# Altium schematic sheet CPU MISC.schdoc
size 451 x 234 mm
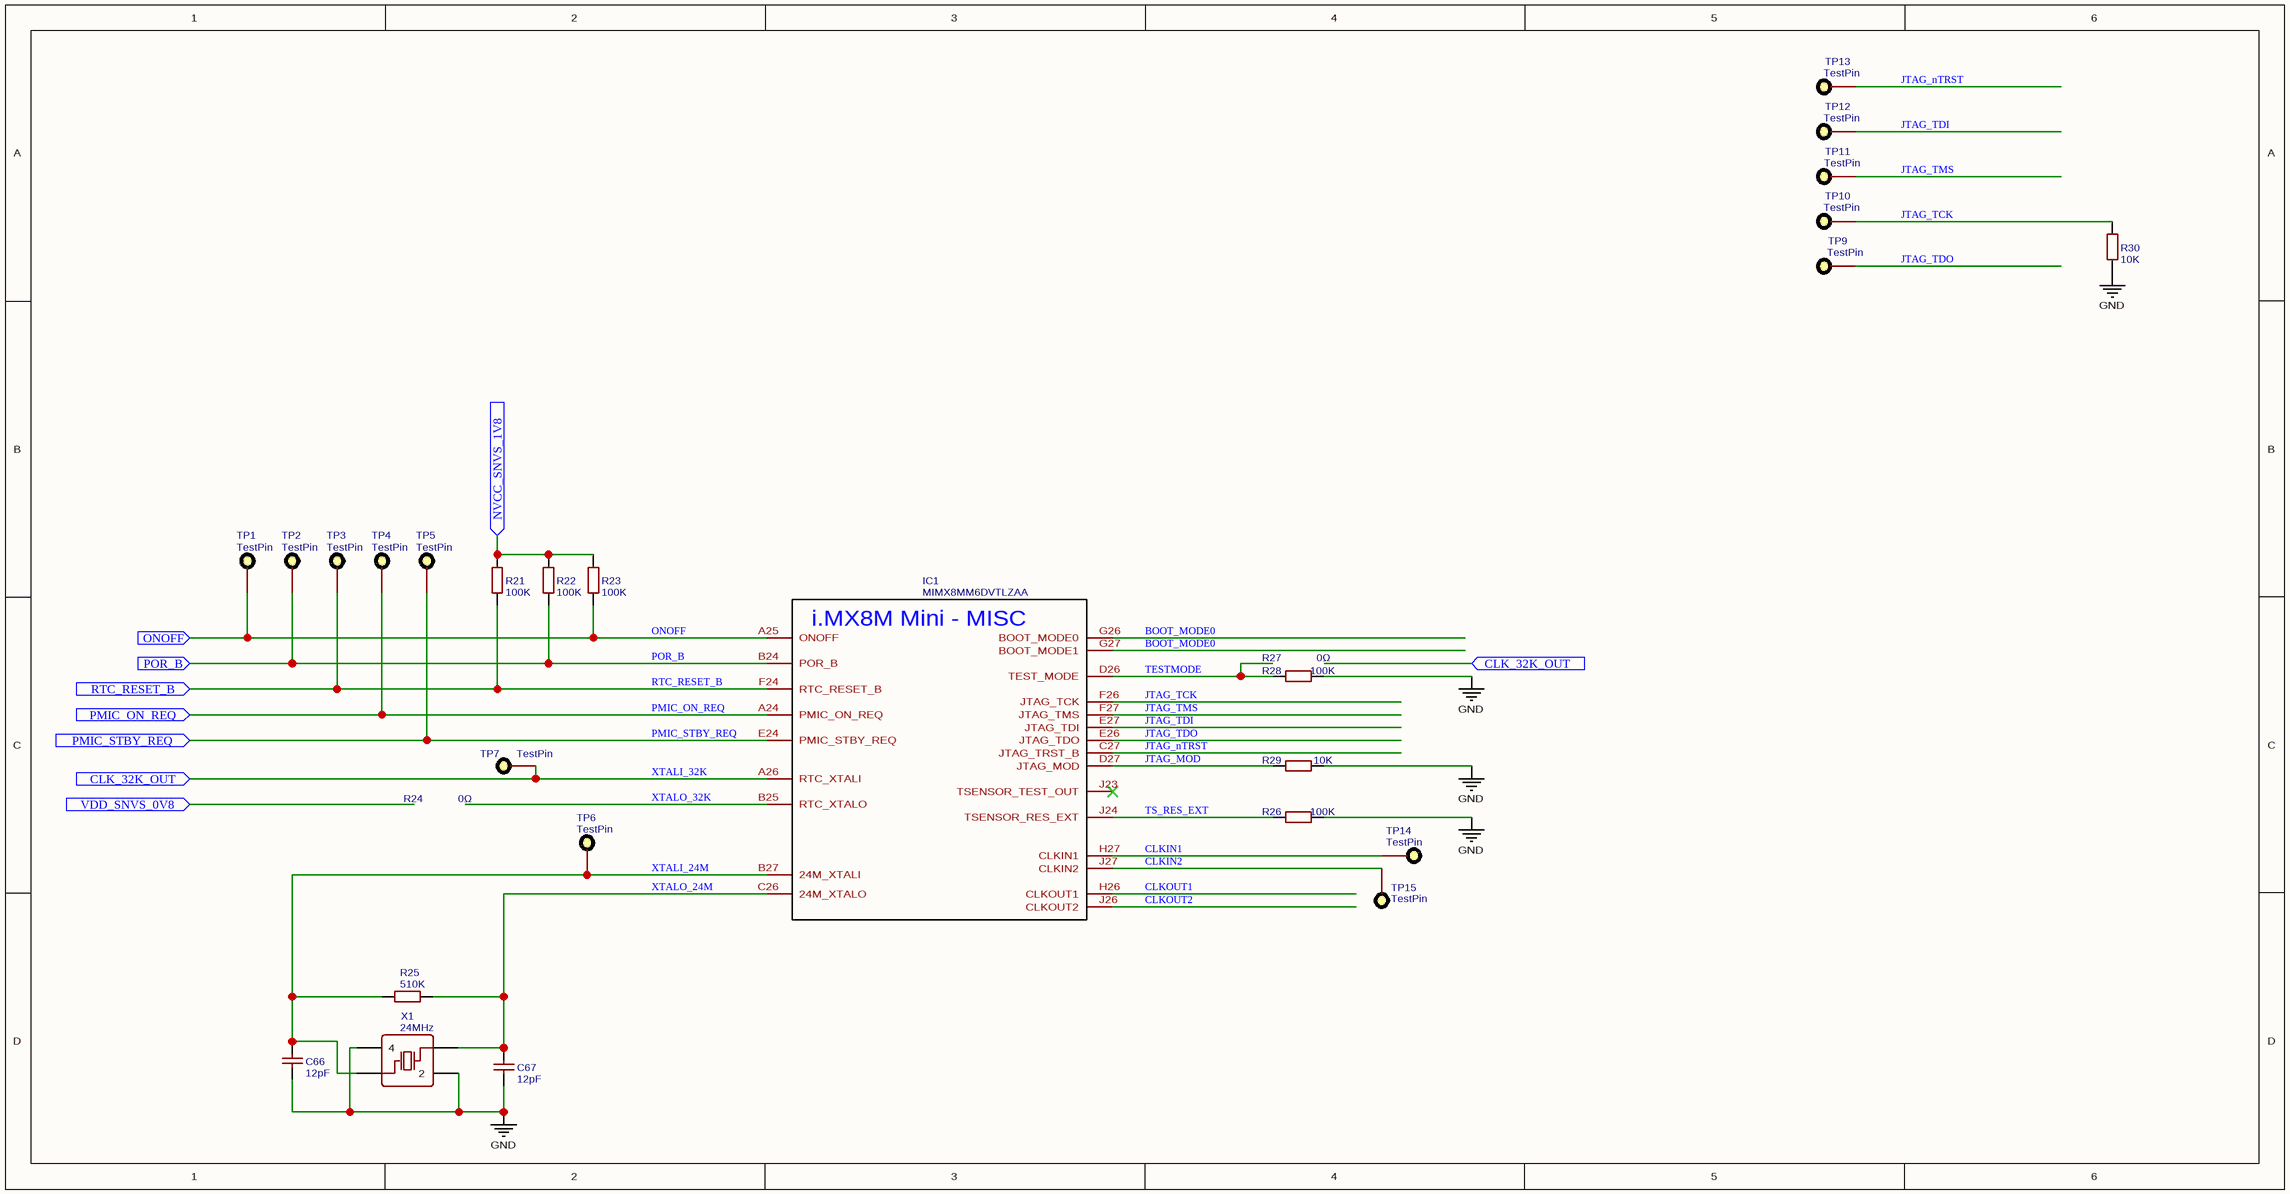
[diagram p0: CPU MISC.schdoc]

## Parts
C66  12pF  [C0402]
C67  12pF  [C0402]
IC1  MIMX8MM6DVTLZAA  [BGA486C50P27X27_1400X1400X125]
R21  100K  [R0402]
R22  100K  [R0402]
R23  100K  [R0402]
R24  0Ω  [1206]
R25  510K  [R0402]
R26  100K  [R0402]
R27  0Ω  [1206]
R28  100K  [R0402]
R29  10K  [R0402]
R30  10K  [R0402]
TP1  TestPin  [TESTPIN]
TP2  TestPin  [TESTPIN]
TP3  TestPin  [TESTPIN]
TP4  TestPin  [TESTPIN]
TP5  TestPin  [TESTPIN]
TP6  TestPin  [TESTPIN]
TP7  TestPin  [TESTPIN]
TP9  TestPin  [TESTPIN]
TP10  TestPin  [TESTPIN]
TP11  TestPin  [TESTPIN]
TP12  TestPin  [TESTPIN]
TP13  TestPin  [TESTPIN]
TP14  TestPin  [TESTPIN]
TP15  TestPin  [TESTPIN]
X1  24MHz  [OSC-SMD_4P-L3.2-W2.5-BL]

## Ports
CLK_32K_OUT (in), NVCC_SNVS_1V8 (in), ONOFF (in), PMIC_ON_REQ (in), PMIC_STBY_REQ (in), POR_B (in), RTC_RESET_B (in), VDD_SNVS_0V8 (in)

## Nets
GND: C66.1 C67.1 R26.1 R28.1 R29.2 R30.1 X1.2 X1.4
BOOT_MODE0: IC1.G26(BOOT_MODE0) IC1.G27(BOOT_MODE1)
CLKIN1: IC1.H27(CLKIN1) TP14.1
CLKIN2: IC1.J27(CLKIN2) TP15.1
CLKOUT1: IC1.H26(CLKOUT1)
CLKOUT2: IC1.J26(CLKOUT2)
JTAG_MOD: IC1.D27(JTAG_MOD) R29.1
JTAG_nTRST: IC1.C27(JTAG_TRST_B) TP13.1
JTAG_TCK: IC1.F26(JTAG_TCK) R30.2 TP10.1
JTAG_TDI: IC1.E27(JTAG_TDI) TP12.1
JTAG_TDO: IC1.E26(JTAG_TDO) TP9.1
JTAG_TMS: IC1.F27(JTAG_TMS) TP11.1
NVCC_SNVS_1V8: R21.2 R22.2 R23.2 ; port NVCC_SNVS_1V8
ONOFF: IC1.A25(ONOFF) R23.1 TP1.1 ; port ONOFF
PMIC_ON_REQ: IC1.A24(PMIC_ON_REQ) TP4.1 ; port PMIC_ON_REQ
PMIC_STBY_REQ: IC1.E24(PMIC_STBY_REQ) TP5.1 ; port PMIC_STBY_REQ
POR_B: IC1.B24(POR_B) R22.1 TP2.1 ; port POR_B
RTC_RESET_B: IC1.F24(RTC_RESET_B) R21.1 TP3.1 ; port RTC_RESET_B
TESTMODE: IC1.D26(TEST_MODE) R28.2
TS_RES_EXT: IC1.J24(TSENSOR_RES_EXT) R26.2
XTALI_24M: C66.2 IC1.B27(24M_XTALI) R25.1 TP6.1 X1.1(OSC1)
XTALI_32K: IC1.A26(RTC_XTALI) TP7.1 ; port CLK_32K_OUT
XTALO_24M: C67.2 IC1.C26(24M_XTALO) R25.2 X1.3(OSC2)
XTALO_32K: IC1.B25(RTC_XTALO)

Not connected (* = marked no-connect by the designer): IC1 J23(TSENSOR_TEST_OUT)*

## Notes on the sheet
- (in symbol MIMX8MM6DVTLZAA) i.MX8M Mini - MISC

## Library data of the parts
C66 C67 = 12pF: BOM_Manufacturer: FH; BOM_Manufacturer Part: 0402CG120J500NT; nameAlias: Capacitance; SMT Type: Basic; BOM_Supplier: LCSC; BOM_Supplier Part: C1547; BOM_JLCPCB SMD: Yes; spicePre: C; spiceSymbolName: 0402CG120J500NT
IC1 = MIMX8MM6DVTLZAA: subpart_no: 2; Contributor: Ke'Ondrae_Mell; spicePre: I; spiceSymbolName: MIMX8MM6DVTLZAA
R21-R23 R26 R28 = 100K: BOM_Manufacturer: UniOhm; BOM_Manufacturer Part: 0402WGF1003TCE; nameAlias: Resistance (Ohms); SMT Type: Basic; BOM_Supplier: LCSC; BOM_Supplier Part: C25741; BOM_JLCPCB SMD: Yes; spicePre: R; spiceSymbolName: 0402WGF1003TCE
R24 R27 = 0Ω: BOM_Manufacturer Part: 0R(000) ±1%; Value: 0Ω; BOM_Supplier Part: undefined; BOM_Supplier: LCSC; spicePre: R; spiceSymbolName: 0Ω
R25 = 510K: BOM_Manufacturer: UniOhm; BOM_Manufacturer Part: 0402WGF5103TCE; nameAlias: Resistance (Ohms); SMT Type: Basic; BOM_Supplier: LCSC; BOM_Supplier Part: C11616; BOM_JLCPCB SMD: Yes; spicePre: R; spiceSymbolName: 0402WGF5103TCE
R29 R30 = 10K: BOM_Manufacturer: UniOhm; BOM_Manufacturer Part: TC0225F1002TCE; nameAlias: Resistance (Ohms); SMT Type: Extend; BOM_Supplier: LCSC; BOM_Supplier Part: C98838; BOM_JLCPCB SMD: Yes; spicePre: R; spiceSymbolName: TC0225F1002TCE
TP1-TP7 TP9-TP15 = TestPin: Contributor: alan.green; sourceId: WTb5nFXR9; timeStamp: 1460711565; spicePre: T; spiceSymbolName: TestPin
X1 = 24MHz: BOM_Manufacturer: KDS; BOM_Manufacturer Part: DSX321G 24MHz; nameAlias: Frequency; Contributor: LCSC; SMT Type: Extend; BOM_Supplier: LCSC; BOM_Supplier Part: C93235; BOM_JLCPCB SMD: Yes; spicePre: X; spiceSymbolName: DSX321G 24MHz